# Altium schematic sheet Schematics_Altium.schdoc
size 307 x 217 mm
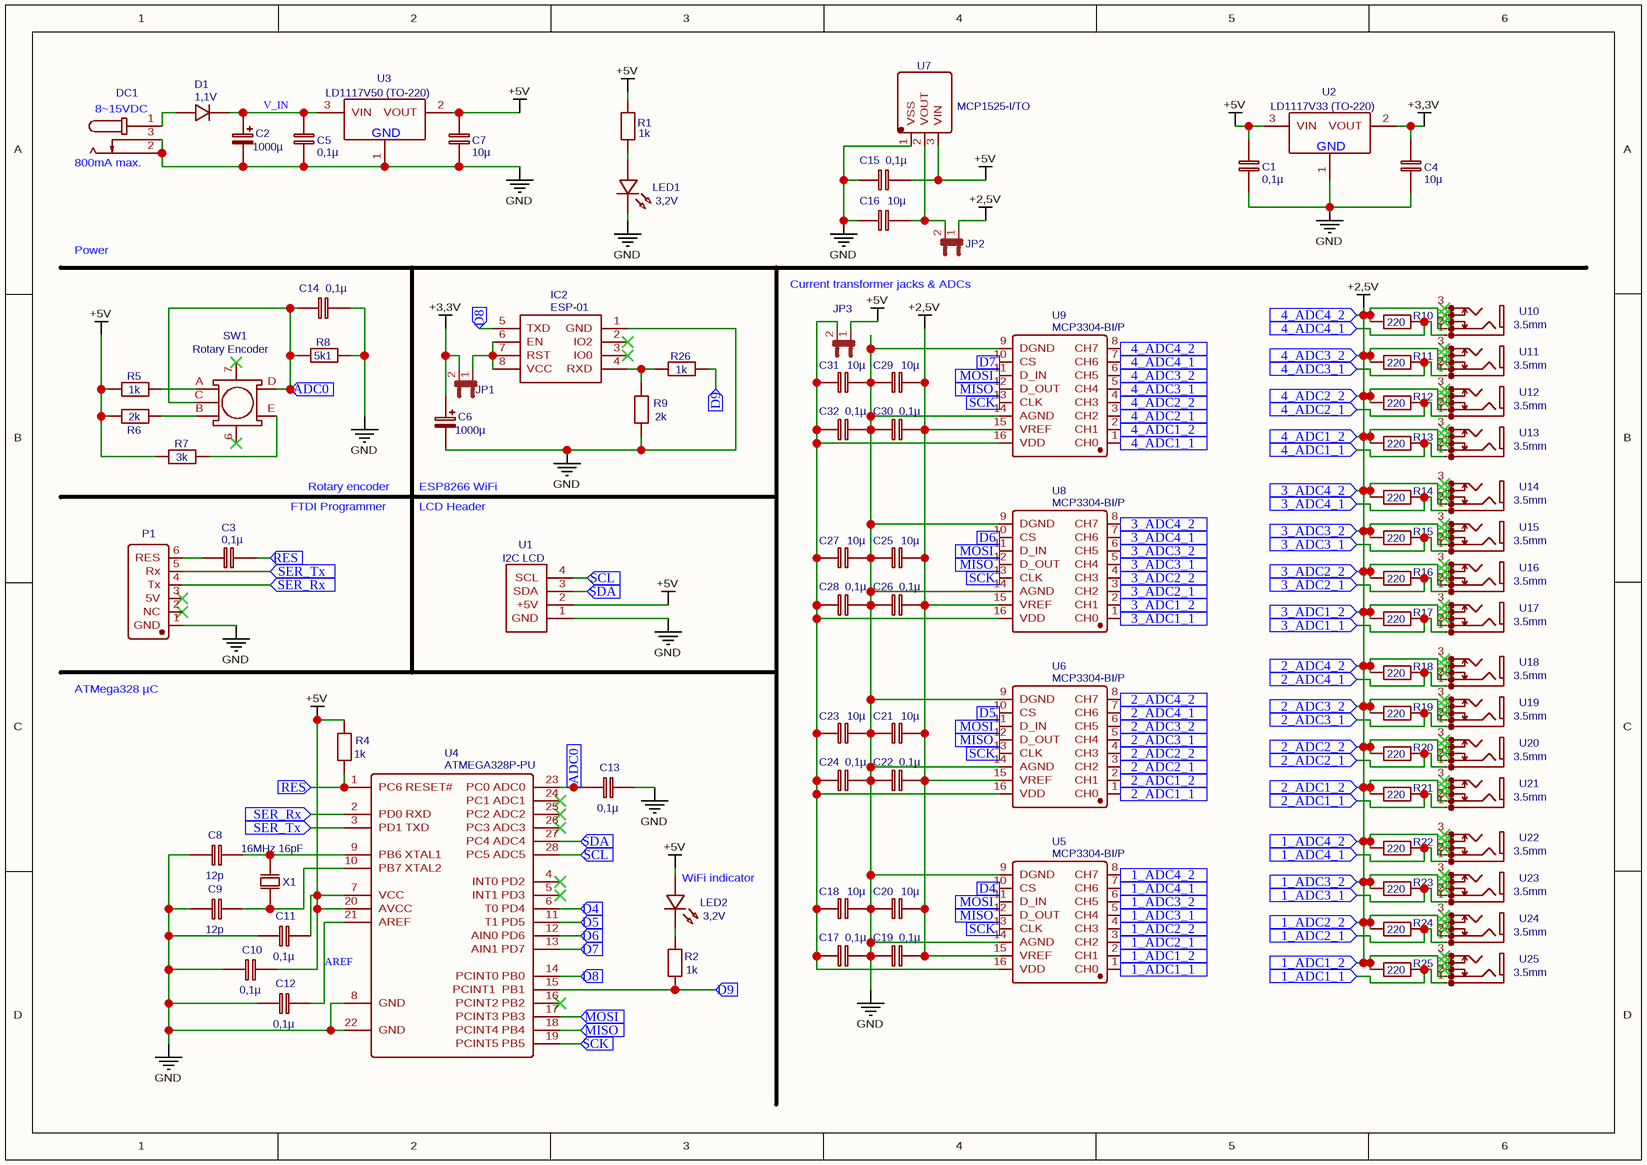
[diagram p0: Schematics_Altium.schdoc]

## Parts
C1  0,1µ  [C0603]
C2  1000µ  [JA0]
C3  0,1µ  [C0603]
C4  10µ  [C0603]
C5  0,1µ  [C0603]
C6  1000µ  [JA0]
C7  10µ  [C0603]
C8  12p  [C0603]
C9  12p  [C0603]
C10  0,1µ  [C0603]
C11  0,1µ  [C0603]
C12  0,1µ  [C0603]
C13  0,1µ  [C0603]
C14  0,1µ  [C0603]
C15  0,1µ  [C0603]
C16  10µ  [C0603]
C17  0,1µ  [C0603]
C18  10µ  [C0603]
C19  0,1µ  [C0603]
C20  10µ  [C0603]
C21  10µ  [C0603]
C22  0,1µ  [C0603]
C23  10µ  [C0603]
C24  0,1µ  [C0603]
C25  10µ  [C0603]
C26  0,1µ  [C0603]
C27  10µ  [C0603]
C28  0,1µ  [C0603]
C29  10µ  [C0603]
C30  0,1µ  [C0603]
C31  10µ  [C0603]
C32  0,1µ  [C0603]
D1  1,1V  [SMA(DO-214AC)]
DC1  DC005-2.0MM  [BKL-DC-2.1]  (value not drawn)
IC2  ESP-01  [ESP01]
JP1  JUMPER-2PTH  [1X02]  (value not drawn)
JP2  JUMPER-2PTH  [1X02]  (value not drawn)
JP3  JUMPER-2PTH  [1X02]  (value not drawn)
LED1  3,2V  [LED0805_BLUE]
LED2  3,2V  [LED0805_BLUE]
P1  FTDI Header  [HDR-TH_6P-P2.54-V-F]  (value not drawn)
R1  1k  [R0603]
R2  1k  [R0603]
R4  1k  [R0603]
R5  1k  [R0603]
R6  2k  [R0603]
R7  3k  [R0603]
R8  5k1  [R0603]
R9  2k  [R0603]
R10  220  [R0603]
R11  220  [R0603]
R12  220  [R0603]
R13  220  [R0603]
R14  220  [R0603]
R15  220  [R0603]
R16  220  [R0603]
R17  220  [R0603]
R18  220  [R0603]
R19  220  [R0603]
R20  220  [R0603]
R21  220  [R0603]
R22  220  [R0603]
R23  220  [R0603]
R24  220  [R0603]
R25  220  [R0603]
R26  1k  [R0603]
SW1  Rotary Encoder  [SW-TH_EC11XXXXXXXX]
U1  I2C LCD  [I2C_2.54-PTW]
U2  LD1117V33 (TO-220)  [TO-220-3_L10.0-W4.5-P2.54-L]
U3  LD1117V50 (TO-220)  [TO-220-3_L10.0-W4.5-P2.54-L]
U4  ATMEGA328P-PU  [DIP-28_L34.6-W7.3-P2.54-LS10.2-BL]
U5  MCP3304-BI/P  [PDIP-16_L19.7-W6.6-P2.54-LS10.9-BL]
U6  MCP3304-BI/P  [PDIP-16_L19.7-W6.6-P2.54-LS10.9-BL]
U7  MCP1525-I/TO  [TO-92-3_L4.9-W3.7-P1.27-L]
U8  MCP3304-BI/P  [PDIP-16_L19.7-W6.6-P2.54-LS10.9-BL]
U9  MCP3304-BI/P  [PDIP-16_L19.7-W6.6-P2.54-LS10.9-BL]
U10  3.5mm  [3.5MM AUDIO JACK CONRAD]
U11  3.5mm  [3.5MM AUDIO JACK CONRAD]
U12  3.5mm  [3.5MM AUDIO JACK CONRAD]
U13  3.5mm  [3.5MM AUDIO JACK CONRAD]
U14  3.5mm  [3.5MM AUDIO JACK CONRAD]
U15  3.5mm  [3.5MM AUDIO JACK CONRAD]
U16  3.5mm  [3.5MM AUDIO JACK CONRAD]
U17  3.5mm  [3.5MM AUDIO JACK CONRAD]
U18  3.5mm  [3.5MM AUDIO JACK CONRAD]
U19  3.5mm  [3.5MM AUDIO JACK CONRAD]
U20  3.5mm  [3.5MM AUDIO JACK CONRAD]
U21  3.5mm  [3.5MM AUDIO JACK CONRAD]
U22  3.5mm  [3.5MM AUDIO JACK CONRAD]
U23  3.5mm  [3.5MM AUDIO JACK CONRAD]
U24  3.5mm  [3.5MM AUDIO JACK CONRAD]
U25  3.5mm  [3.5MM AUDIO JACK CONRAD]
X1  16MHz 16pF  [HC-49S_L11.4-W4.8]

## Ports
1_ADC1_1 (in), 1_ADC1_2 (in), 1_ADC2_1 (in), 1_ADC2_2 (in), 1_ADC3_1 (in), 1_ADC3_2 (in), 1_ADC4_1 (in), 1_ADC4_2 (in), 2_ADC1_1 (in), 2_ADC1_2 (in), 2_ADC2_1 (in), 2_ADC2_2 (in), 2_ADC3_1 (in), 2_ADC3_2 (in), 2_ADC4_1 (in), 2_ADC4_2 (in), 3_ADC1_1 (in), 3_ADC1_2 (in), 3_ADC2_1 (in), 3_ADC2_2 (in), 3_ADC3_1 (in), 3_ADC3_2 (in), 3_ADC4_1 (in), 3_ADC4_2 (in), 4_ADC1_1 (in), 4_ADC1_2 (in), 4_ADC2_1 (in), 4_ADC2_2 (in), 4_ADC3_1 (in), 4_ADC3_2 (in), 4_ADC4_1 (in), 4_ADC4_2 (in), ADC0 (in), D4 (in), D5 (in), D6 (in), D7 (in), D8 (in), D9 (in), MISO (in), MOSI (in), RES (in), SCK (in), SCL (in), SDA (in), SER_Rx (in), SER_Tx (in)

## Nets
+2,5V: C19.2 C20.2 C21.2 C22.2 C25.2 C26.2 C29.2 C30.2 JP2.1 R10.2 R11.2 R12.2 R13.2 R14.2 R15.2 R16.2 R17.2 R18.2 R19.2 R20.2 R21.2 R22.2 R23.2 R24.2 R25.2 U5.2(CH1) U5.4(CH3) U5.6(CH5) U5.8(CH7) U5.15(VREF) U6.2(CH1) U6.4(CH3) U6.6(CH5) U6.8(CH7) U6.15(VREF) U8.2(CH1) U8.4(CH3) U8.6(CH5) U8.8(CH7) U8.15(VREF) U9.2(CH1) U9.4(CH3) U9.6(CH5) U9.8(CH7) U9.15(VREF) U10.2(TIP) U11.2(TIP) U12.2(TIP) U13.2(TIP) U14.2(TIP) U15.2(TIP) U16.2(TIP) U17.2(TIP) U18.2(TIP) U19.2(TIP) U20.2(TIP) U21.2(TIP) U22.2(TIP) U23.2(TIP) U24.2(TIP) U25.2(TIP) ; port 1_ADC1_2, port 1_ADC2_2, port 1_ADC3_2, port 1_ADC4_2, port 4_ADC1_2, port 4_ADC2_2, port 4_ADC3_2, port 4_ADC4_2, port 3_ADC4_2, port 3_ADC3_2, port 3_ADC2_2, port 3_ADC1_2, port 2_ADC4_2, port 2_ADC3_2, port 2_ADC2_2, port 2_ADC1_2
+3,3V: C4.1 C6.1 JP1.2 U2.2(VOUT)
+5V: C1.1 C7.1 C10.1 C11.1 C15.2 JP3.1 LED2.1 R1.1 R4.1 R5.1 R6.1 R7.1 U1.2(+5V) U2.3(VIN) U3.2(VOUT) U4.7(VCC) U4.20(AVCC) U7.3(VIN)
GND: C1.2 C2.2 C4.2 C5.2 C6.2 C7.2 C8.2 C9.2 C10.2 C11.2 C12.2 C13.1 C14.2 C15.1 C16.1 C17.2 C18.2 C19.1 C20.1 C21.1 C22.1 C23.2 C24.2 C25.1 C26.1 C27.2 C28.2 C29.1 C30.1 C31.2 C32.2 DC1.2 DC1.3 IC2.1(GND) LED1.2 P1.1(GND) R8.2 R9.1 U1.1(GND) U2.1(GND) U3.1(GND) U4.8(GND) U4.22(GND) U5.9(DGND) U5.14(AGND) U6.9(DGND) U6.14(AGND) U7.1(VSS) U8.9(DGND) U8.14(AGND) U9.9(DGND) U9.14(AGND)
1_ADC1_1: R25.1 U5.1(CH0) U25.1(SLV) ; port 1_ADC1_1
1_ADC2_1: R24.1 U5.3(CH2) U24.1(SLV) ; port 1_ADC2_1
1_ADC3_1: R23.1 U5.5(CH4) U23.1(SLV) ; port 1_ADC3_1
1_ADC4_1: R22.1 U5.7(CH6) U22.1(SLV) ; port 1_ADC4_1
2_ADC1_1: R21.1 U6.1(CH0) U21.1(SLV) ; port 2_ADC1_1
2_ADC2_1: R20.1 U6.3(CH2) U20.1(SLV) ; port 2_ADC2_1
2_ADC3_1: R19.1 U6.5(CH4) U19.1(SLV) ; port 2_ADC3_1
2_ADC4_1: R18.1 U6.7(CH6) U18.1(SLV) ; port 2_ADC4_1
3_ADC1_1: R17.1 U8.1(CH0) U17.1(SLV) ; port 3_ADC1_1
3_ADC2_1: R16.1 U8.3(CH2) U16.1(SLV) ; port 3_ADC2_1
3_ADC3_1: R15.1 U8.5(CH4) U15.1(SLV) ; port 3_ADC3_1
3_ADC4_1: R14.1 U8.7(CH6) U14.1(SLV) ; port 3_ADC4_1
4_ADC1_1: R13.1 U9.1(CH0) U13.1(SLV) ; port 4_ADC1_1
4_ADC2_1: R12.1 U9.3(CH2) U12.1(SLV) ; port 4_ADC2_1
4_ADC3_1: R11.1 U9.5(CH4) U11.1(SLV) ; port 4_ADC3_1
4_ADC4_1: R10.1 U9.7(CH6) U10.1(SLV) ; port 4_ADC4_1
ADC0: C13.2 C14.1 R8.1 SW1.C SW1.D U4.23(PC0_ADC0) ; port ADC0
AREF: C12.1 U4.21(AREF)
D4: U4.6(T0_PD4) U5.10(CS) ; port D4
D5: U4.11(T1_PD5) U6.10(CS) ; port D5
D6: U4.12(AIN0_PD6) U8.10(CS) ; port D6
D7: U4.13(AIN1_PD7) U9.10(CS) ; port D7
D8: IC2.5(TXD) U4.14(PCINT0_PB0) ; port D8
D9: R2.2 R26.2 U4.15(PCINT1__PB1) ; port D9
MISO: U4.18(PCINT4_PB4) U5.12(D_OUT) U6.12(D_OUT) U8.12(D_OUT) U9.12(D_OUT) ; port MISO
MOSI: U4.17(PCINT3_PB3) U5.11(D_IN) U6.11(D_IN) U8.11(D_IN) U9.11(D_IN) ; port MOSI
RES: C3.2 R4.2 U4.1(PC6_RESET#) ; port RES
SCK: U4.19(PCINT5_PB5) U5.13(CLK) U6.13(CLK) U8.13(CLK) U9.13(CLK) ; port SCK
SCL: U1.4(SCL) U4.28(PC5_ADC5) ; port SCL
SDA: U1.3(SDA) U4.27(PC4_ADC4) ; port SDA
SER_Rx: P1.4(Tx) U4.2(PD0_RXD) ; port SER_Rx
SER_Tx: P1.5(Rx) U4.3(PD1_TXD) ; port SER_Tx
V_IN: C2.1 C5.1 D1.1 U3.3(VIN)
NetC3_1: C3.1 P1.6(RES)
NetC8_1: C8.1 U4.9(PB6_XTAL1) X1.2(OSC2)
NetC9_1: C9.1 U4.10(PB7_XTAL2) X1.1(OSC1)
NetC16_2: C16.2 JP2.2 U7.2(VOUT)
NetC17_1: C17.1 C18.1 C23.1 C24.1 C27.1 C28.1 C31.1 C32.1 JP3.2 U5.16(VDD) U6.16(VDD) U8.16(VDD) U9.16(VDD)
NetD1_2: D1.2 DC1.1
NetIC2_4: IC2.4(RXD) R9.2 R26.1
NetIC2_6: IC2.6(EN) IC2.7(RST) IC2.8(VCC) JP1.1
NetLED1_1: LED1.1 R1.2
NetLED2_2: LED2.2 R2.1
NetR5_2: R5.2 SW1.A
NetR6_2: R6.2 SW1.B
NetR7_2: R7.2 SW1.E

Not connected (* = marked no-connect by the designer): IC2 2(IO2)* 3(IO0)*; P1 2(NC)* 3(5V)*; SW1 6* 7*; U4 4(INT0_PD2)* 5(INT1_PD3)* 16(PCINT2_PB2)* 24(PC1_ADC1)* 25(PC2_ADC2)* 26(PC3_ADC3)*; U10 3(RNG)* 4* 5*; U11 3(RNG)* 4* 5*; U12 3(RNG)* 4* 5*; U13 3(RNG)* 4* 5*; U14 3(RNG)* 4* 5*; U15 3(RNG)* 4* 5*; U16 3(RNG)* 4* 5*; U17 3(RNG)* 4* 5*; U18 3(RNG)* 4* 5*; U19 3(RNG)* 4* 5*; U20 3(RNG)* 4* 5*; U21 3(RNG)* 4* 5*; U22 3(RNG)* 4* 5*; U23 3(RNG)* 4* 5*; U24 3(RNG)* 4* 5*; U25 3(RNG)* 4* 5*

## Notes on the sheet
- (near DC1) 800mA max.
- (near DC1) 8~15VDC
- Power
- Current transformer jacks & ADCs
- FTDI Programmer
- Rotary encoder
- (near C6) ESP8266 WiFi
- LCD Header
- ATMega328 µC
- (near LED2) WiFi indicator

## Library data of the parts
C1 C3 C5 C10-C15 C17 C19 C22 C24 C26 C28 C30 C32 = 0,1µ: nameAlias: Value(F); Contributor: LCEDA_Lib; spicePre: C; spiceSymbolName: C_0603_EU
C2 C6 = 1000µ: nameAlias: Value(F); Contributor: LCEDA_Lib; Package Display: No; spicePre: C; spiceSymbolName: C_Tan_SMD_A_EU
C4 C7 C16 C18 C20 C21 C23 C25 C27 C29 C31 = 10µ: nameAlias: Value(F); Contributor: LCEDA_Lib; spicePre: C; spiceSymbolName: C_0603_EU
C8 C9 = 12p: nameAlias: Value(F); Contributor: LCEDA_Lib; spicePre: C; spiceSymbolName: C_0603_EU
D1 = 1,1V: BOM_Manufacturer: BLUE ROCKET; BOM_Manufacturer Part: 1N4007W; Contributor: LCEDA_Lib; Package Display: No; BOM_Supplier: LCSC; BOM_Supplier Part: C328592; spicePre: D; spiceSymbolName: 1N4007W
DC1 = DC005-2.0MM: BOM_Manufacturer: SOFNG; BOM_Supplier: LCSC; BOM_Manufacturer Part: DC005-2.0MM; BOM_Supplier Part: C111567; spicePre: D; spiceSymbolName: DC005-2.0MM
IC2 = ESP-01: Contributor: thelion; spicePre: I; spiceSymbolName: ESP-01
JP1-JP3 = JUMPER-2PTH: description: Jumper; Contributor: SparkFun; Package Display: No; spicePre: J; spiceSymbolName: JUMPER-2PTH
LED1 LED2 = 3,2V: BOM_Manufacturer: 方舟 ARKLED; BOM_Manufacturer Part: D-B080508B1-KS2; Contributor: LCEDA_Lib; Package Display: No; BOM_Supplier Part: C108412; spicePre: L; spiceSymbolName: LED-0805_B
R1 R2 R4 R5 R26 = 1k: nameAlias: Value(Ω); Contributor: LCEDA_Lib; spicePre: R; spiceSymbolName: R_0603_EU
R6 R9 = 2k: nameAlias: Value(Ω); Contributor: LCEDA_Lib; spicePre: R; spiceSymbolName: R_0603_EU
R7 = 3k: nameAlias: Value(Ω); Contributor: LCEDA_Lib; spicePre: R; spiceSymbolName: R_0603_EU
R8 = 5k1: nameAlias: Value(Ω); Contributor: LCEDA_Lib; spicePre: R; spiceSymbolName: R_0603_EU
R10-R25 = 220: nameAlias: Value(Ω); Contributor: LCEDA_Lib; spicePre: R; spiceSymbolName: R_0603_EU
SW1 = Rotary Encoder: BOM_Manufacturer: ALPS Electric; BOM_Manufacturer Part: EC11E09244BS; Contributor: LCSC; BOM_Supplier: LCSC; BOM_Supplier Part: C470742; spicePre: S; spiceSymbolName: EC11E09244BS
U1 = I2C LCD: Contributor: paultwick; spicePre: U; spiceSymbolName: I2C LCD
U2 = LD1117V33 (TO-220): BOM_Manufacturer: STMicroelectronics; Contributor: LCSC; SMT Type: Extend; BOM_Supplier: LCSC; BOM_Supplier Part: C283467; BOM_Manufacturer Part: LD1117V33; BOM_LCSC Assembly: Yes; spicePre: U; spiceSymbolName: LD1117V33
U3 = LD1117V50 (TO-220): BOM_Manufacturer: STMicroelectronics; BOM_Manufacturer Part: LD1117V33; Contributor: LCSC; SMT Type: Extend; BOM_Supplier: LCSC; BOM_Supplier Part: C283467; BOM_LCSC Assembly: Yes; spicePre: U; spiceSymbolName: LD1117V33
U4 = ATMEGA328P-PU: BOM_Manufacturer: MICROCHIP; sourceId: Oic6oiASL; Contributor: LCSC; timeStamp: 1451725987; BOM_Supplier: LCSC; BOM_Manufacturer Part: ATMEGA328P-PU; image: //image.lceda.cn/szlcsc/C33901.jpg; BOM_Supplier Part: C33901; spicePre: U; spiceSymbolName: ATMEGA328P-PU
U7 = MCP1525-I/TO: BOM_Manufacturer: Microchip Tech; Contributor: LCSC; BOM_Supplier: LCSC; BOM_Supplier Part: C184389; BOM_Manufacturer Part: MCP1525-I/TO; spicePre: U; spiceSymbolName: MCP1525-I/TO
X1 = 16MHz 16pF: BOM_Manufacturer: CITIZEN; BOM_Manufacturer Part: HCM4916000000ABJT; nameAlias: Frequency; Contributor: LCSC; Package Display: No; BOM_Supplier: LCSC; BOM_Supplier Part: C326544; spicePre: X; spiceSymbolName: HCM4916000000ABJT
U5 U6 U8 U9 = MCP3304-BI/P: spicePre: X; spiceSymbolName: MCP3304-BI/P